# EAGLE schematic Digital BMS Slave board  (EAGLE 9.5.2)
Assembly variants: Full_Assembly_TOP, Full_Assembly_BOT, PC_Test_TOP, PC_Test_BOT

## Sheet 1 of 2
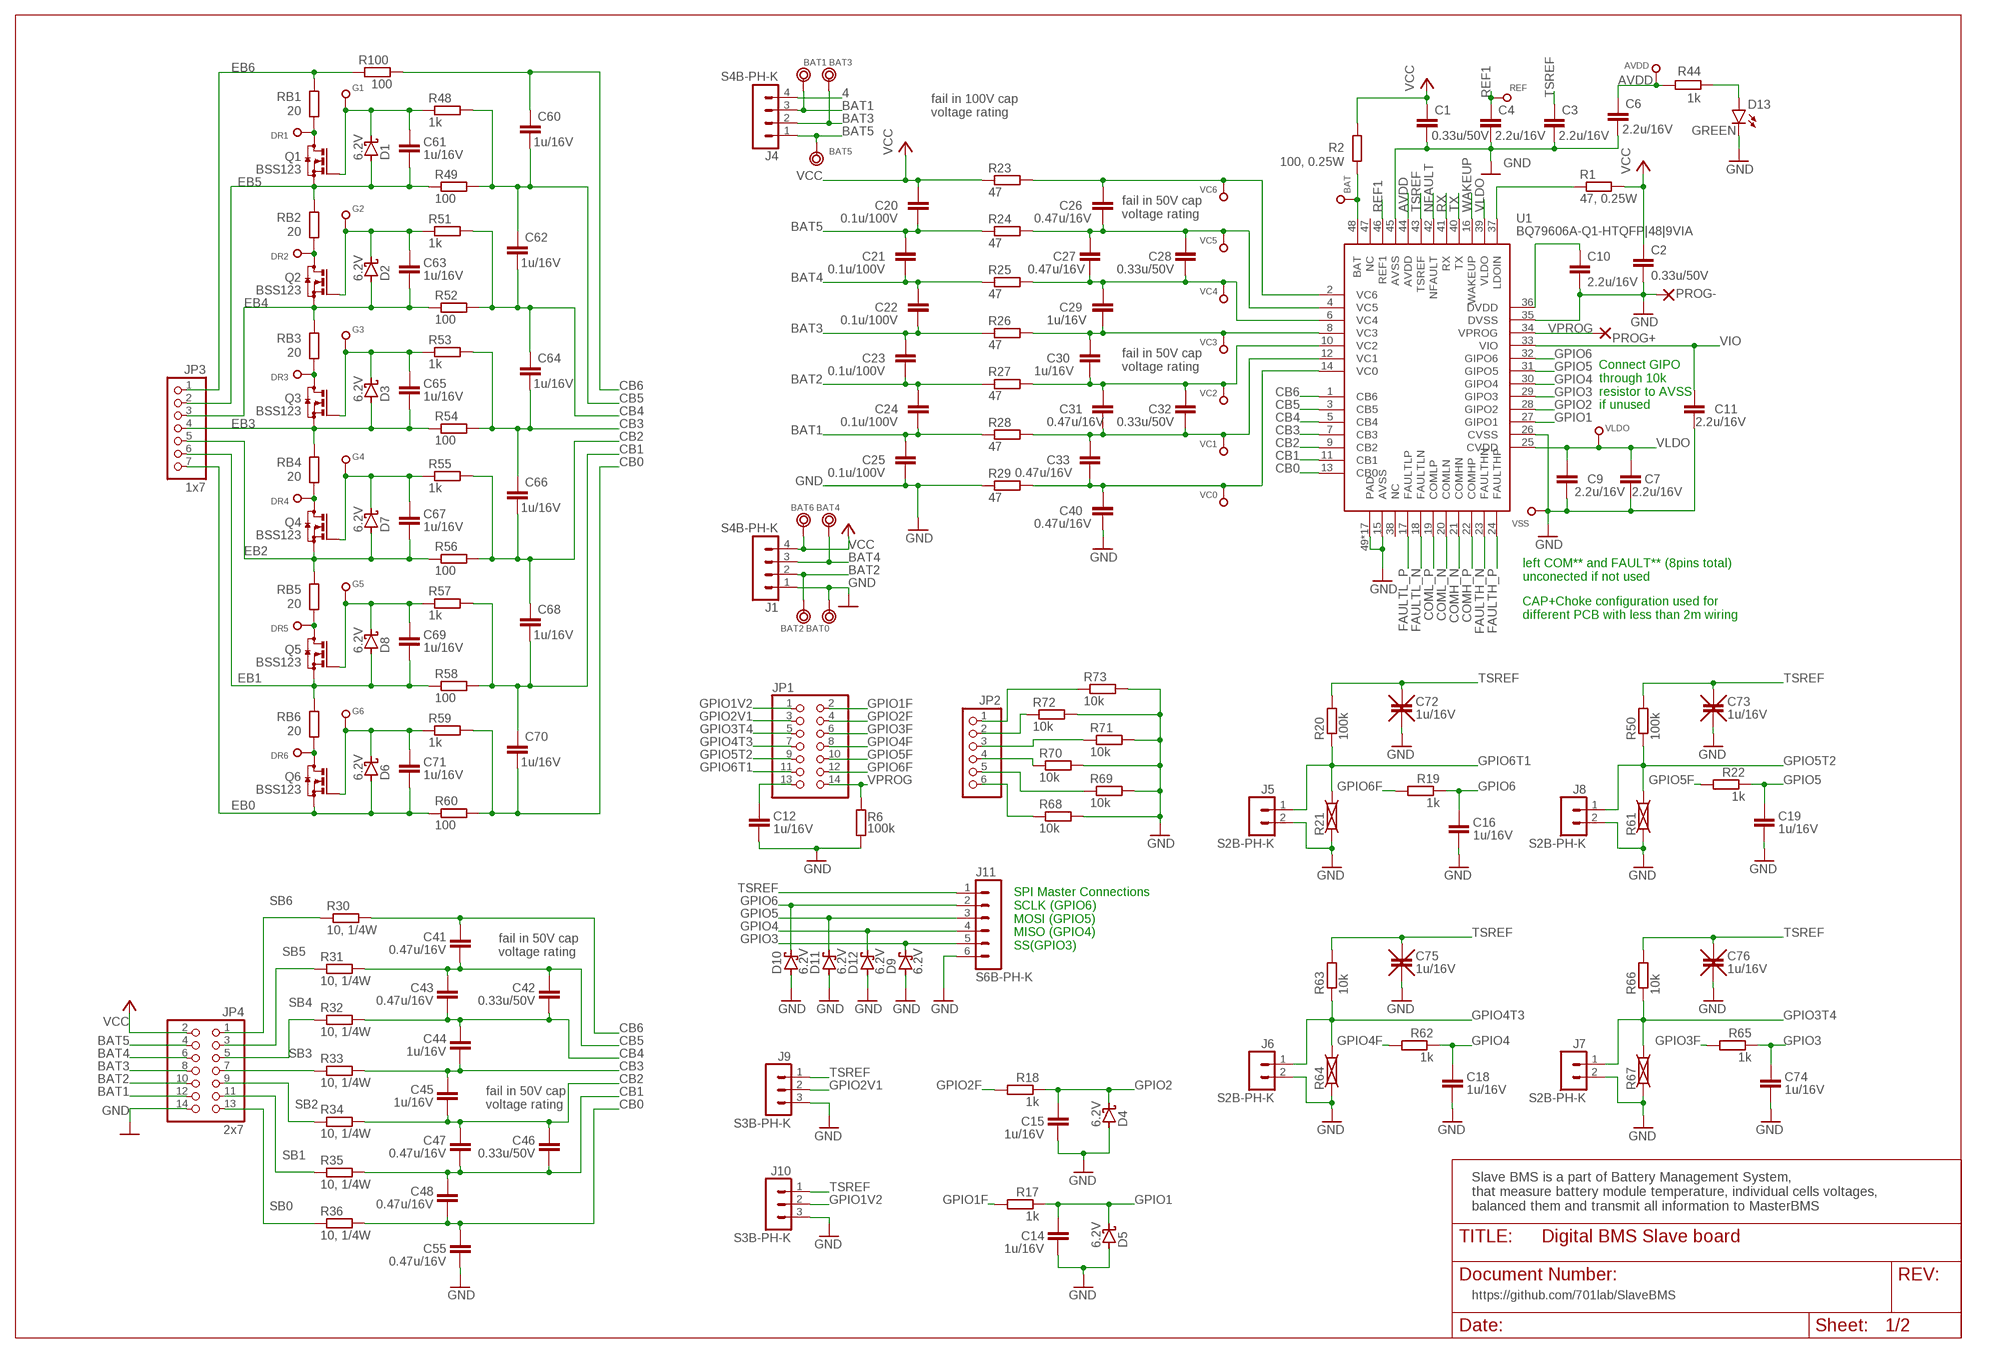
[diagram p0: schematic, sheet 1]

### Parts
AVDD  TEST_PAD-[1.27MM_SK]  [TP1.27MM_MASK_SILKSCREEN]  (not fitted in variant Full_Assembly_BOT)  (not fitted in variant PC_Test_BOT)
BAT  TEST_PAD-[1MM_SK]  [TP1MM_MASK_SILKSCREEN]  (not fitted in variant Full_Assembly_BOT)  (not fitted in variant PC_Test_BOT)
BAT0  TEST_RING  [TEST_RING]  (not fitted in variant Full_Assembly_BOT)  (not fitted in variant PC_Test_BOT)
BAT1  TEST_RING  [TEST_RING]  (not fitted in variant Full_Assembly_BOT)  (not fitted in variant PC_Test_BOT)
BAT2  TEST_RING  [TEST_RING]  (not fitted in variant Full_Assembly_BOT)  (not fitted in variant PC_Test_BOT)
BAT3  TEST_RING  [TEST_RING]  (not fitted in variant Full_Assembly_BOT)  (not fitted in variant PC_Test_BOT)
BAT4  TEST_RING  [TEST_RING]  (not fitted in variant Full_Assembly_BOT)  (not fitted in variant PC_Test_BOT)
BAT5  TEST_RING  [TEST_RING]  (not fitted in variant Full_Assembly_BOT)  (not fitted in variant PC_Test_BOT)
BAT6  TEST_RING  [TEST_RING]  (not fitted in variant Full_Assembly_BOT)  (not fitted in variant PC_Test_BOT)
C1  0.33u/50V  C-EU-K1206  [C1206K]  (not fitted in variant Full_Assembly_BOT)  (not fitted in variant PC_Test_BOT)
C2  0.33u/50V  C-EU-K1206  [C1206K]  (not fitted in variant Full_Assembly_BOT)  (not fitted in variant PC_Test_BOT)
C3  2.2u/16V  C-EU0603  [C0603]  (not fitted in variant Full_Assembly_BOT)  (not fitted in variant PC_Test_BOT)
C4  2.2u/16V  C-EU0603  [C0603]  (not fitted in variant Full_Assembly_BOT)  (not fitted in variant PC_Test_BOT)
C6  2.2u/16V  C-EU0603  [C0603]  (not fitted in variant Full_Assembly_BOT)  (not fitted in variant PC_Test_BOT)
C7  2.2u/16V  C-EU0603  [C0603]  (not fitted in variant Full_Assembly_BOT)  (not fitted in variant PC_Test_BOT)
C9  2.2u/16V  C-EU0603  [C0603]  (not fitted in variant Full_Assembly_BOT)  (not fitted in variant PC_Test_BOT)
C10  2.2u/16V  C-EU0603  [C0603]  (not fitted in variant Full_Assembly_BOT)  (not fitted in variant PC_Test_BOT)
C11  2.2u/16V  C-EU0603  [C0603]  (not fitted in variant Full_Assembly_BOT)  (not fitted in variant PC_Test_BOT)
C12  1u/16V  C-EU0603  [C0603]  (not fitted in variant Full_Assembly_BOT)  (not fitted in variant PC_Test_BOT)
C14  1u/16V  C-EU0603  [C0603]  (not fitted in variant Full_Assembly_BOT)  (not fitted in variant PC_Test_BOT)
C15  1u/16V  C-EU0603  [C0603]  (not fitted in variant Full_Assembly_BOT)  (not fitted in variant PC_Test_BOT)
C16  1u/16V  C-EU0603  [C0603]  (not fitted in variant Full_Assembly_BOT)  (not fitted in variant PC_Test_BOT)
C18  1u/16V  C-EU0603  [C0603]  (not fitted in variant Full_Assembly_BOT)  (not fitted in variant PC_Test_BOT)
C19  1u/16V  C-EU0603  [C0603]  (not fitted in variant Full_Assembly_BOT)  (not fitted in variant PC_Test_BOT)
C20  0.1u/100V  C-EU-K1206  [C1206K]  (not fitted in variant Full_Assembly_BOT)  (not fitted in variant PC_Test_BOT)
C21  0.1u/100V  C-EU-K1206  [C1206K]  (not fitted in variant Full_Assembly_BOT)  (not fitted in variant PC_Test_BOT)
C22  0.1u/100V  C-EU-K1206  [C1206K]  (not fitted in variant Full_Assembly_BOT)  (not fitted in variant PC_Test_BOT)
C23  0.1u/100V  C-EU-K1206  [C1206K]  (not fitted in variant Full_Assembly_BOT)  (not fitted in variant PC_Test_BOT)
C24  0.1u/100V  C-EU-K1206  [C1206K]  (not fitted in variant Full_Assembly_BOT)  (not fitted in variant PC_Test_BOT)
C25  0.1u/100V  C-EU-K1206  [C1206K]  (not fitted in variant Full_Assembly_BOT)  (not fitted in variant PC_Test_BOT)
C26  0.47u/16V  C-EU0603  [C0603]  (not fitted in variant Full_Assembly_BOT)  (not fitted in variant PC_Test_BOT)
C27  0.47u/16V  C-EU0603  [C0603]  (not fitted in variant Full_Assembly_BOT)  (not fitted in variant PC_Test_BOT)
C28  0.33u/50V  C-EU0603  [C0603]  (not fitted in variant Full_Assembly_BOT)  (not fitted in variant PC_Test_BOT)
C29  1u/16V  C-EU-K0805  [C0805K]  (not fitted in variant Full_Assembly_BOT)  (not fitted in variant PC_Test_BOT)
C30  1u/16V  C-EU-K0805  [C0805K]  (not fitted in variant Full_Assembly_BOT)  (not fitted in variant PC_Test_BOT)
C31  0.47u/16V  C-EU0603  [C0603]  (not fitted in variant Full_Assembly_BOT)  (not fitted in variant PC_Test_BOT)
C32  0.33u/50V  C-EU0603  [C0603]  (not fitted in variant Full_Assembly_BOT)  (not fitted in variant PC_Test_BOT)
C33  0.47u/16V  C-EU0603  [C0603]  (not fitted in variant Full_Assembly_BOT)  (not fitted in variant PC_Test_BOT)
C40  0.47u/16V  C-EU0603  [C0603]  (not fitted in variant Full_Assembly_BOT)  (not fitted in variant PC_Test_BOT)
C41  0.47u/16V  C-EU0603  [C0603]  (not fitted in variant Full_Assembly_BOT)  (not fitted in variant PC_Test_BOT)
C42  0.33u/50V  C-EU0603  [C0603]  (not fitted in variant Full_Assembly_BOT)  (not fitted in variant PC_Test_BOT)
C43  0.47u/16V  C-EU0603  [C0603]  (not fitted in variant Full_Assembly_BOT)  (not fitted in variant PC_Test_BOT)
C44  1u/16V  C-EU-K0805  [C0805K]  (not fitted in variant Full_Assembly_BOT)  (not fitted in variant PC_Test_BOT)
C45  1u/16V  C-EU-K0805  [C0805K]  (not fitted in variant Full_Assembly_BOT)  (not fitted in variant PC_Test_BOT)
C46  0.33u/50V  C-EU0603  [C0603]  (not fitted in variant Full_Assembly_BOT)  (not fitted in variant PC_Test_BOT)
C47  0.47u/16V  C-EU0603  [C0603]  (not fitted in variant Full_Assembly_BOT)  (not fitted in variant PC_Test_BOT)
C48  0.47u/16V  C-EU0603  [C0603]  (not fitted in variant Full_Assembly_BOT)  (not fitted in variant PC_Test_BOT)
C55  0.47u/16V  C-EU0603  [C0603]  (not fitted in variant Full_Assembly_BOT)  (not fitted in variant PC_Test_BOT)
C60  1u/16V  C-EU0603  [C0603]  (not fitted in variant Full_Assembly_BOT)  (not fitted in variant PC_Test_BOT)
C61  1u/16V  C-EU0603  [C0603]  (not fitted in variant Full_Assembly_BOT)  (not fitted in variant PC_Test_BOT)
C62  1u/16V  C-EU0603  [C0603]  (not fitted in variant Full_Assembly_BOT)  (not fitted in variant PC_Test_BOT)
C63  1u/16V  C-EU0603  [C0603]  (not fitted in variant Full_Assembly_BOT)  (not fitted in variant PC_Test_BOT)
C64  1u/16V  C-EU0603  [C0603]  (not fitted in variant Full_Assembly_BOT)  (not fitted in variant PC_Test_BOT)
C65  1u/16V  C-EU0603  [C0603]  (not fitted in variant Full_Assembly_BOT)  (not fitted in variant PC_Test_BOT)
C66  1u/16V  C-EU0603  [C0603]  (not fitted in variant Full_Assembly_BOT)  (not fitted in variant PC_Test_BOT)
C67  1u/16V  C-EU0603  [C0603]  (not fitted in variant Full_Assembly_BOT)  (not fitted in variant PC_Test_BOT)
C68  1u/16V  C-EU0603  [C0603]  (not fitted in variant Full_Assembly_BOT)  (not fitted in variant PC_Test_BOT)
C69  1u/16V  C-EU0603  [C0603]  (not fitted in variant Full_Assembly_BOT)  (not fitted in variant PC_Test_BOT)
C70  1u/16V  C-EU0603  [C0603]  (not fitted in variant Full_Assembly_BOT)  (not fitted in variant PC_Test_BOT)
C71  1u/16V  C-EU0603  [C0603]  (not fitted in variant Full_Assembly_BOT)  (not fitted in variant PC_Test_BOT)
C72  1u/16V  C-EU-K-X0603  [C0603K-X]  (not fitted in variant Full_Assembly_BOT)  (not fitted in variant PC_Test_BOT)
C73  1u/16V  C-EU-K-X0603  [C0603K-X]  (not fitted in variant Full_Assembly_BOT)  (not fitted in variant PC_Test_BOT)
C74  1u/16V  C-EU0603  [C0603]  (not fitted in variant Full_Assembly_BOT)  (not fitted in variant PC_Test_BOT)
C75  1u/16V  C-EU-K-X0603  [C0603K-X]  (not fitted in variant Full_Assembly_BOT)  (not fitted in variant PC_Test_BOT)
C76  1u/16V  C-EU-K-X0603  [C0603K-X]  (not fitted in variant Full_Assembly_BOT)  (not fitted in variant PC_Test_BOT)
D1  6.2V  SOD323-ZENER  [SOD323_ST]  (not fitted in variant Full_Assembly_BOT)  (not fitted in variant PC_Test_BOT)
D2  6.2V  SOD323-ZENER  [SOD323_ST]  (not fitted in variant Full_Assembly_BOT)  (not fitted in variant PC_Test_BOT)
D3  6.2V  SOD323-ZENER  [SOD323_ST]  (not fitted in variant Full_Assembly_BOT)  (not fitted in variant PC_Test_BOT)
D4  6.2V  SOD323-ZENER  [SOD323_ST]  (not fitted in variant Full_Assembly_BOT)  (not fitted in variant PC_Test_BOT)
D5  6.2V  SOD323-ZENER  [SOD323_ST]  (not fitted in variant Full_Assembly_BOT)  (not fitted in variant PC_Test_BOT)
D6  6.2V  SOD323-ZENER  [SOD323_ST]  (not fitted in variant Full_Assembly_BOT)  (not fitted in variant PC_Test_BOT)
D7  6.2V  SOD323-ZENER  [SOD323_ST]  (not fitted in variant Full_Assembly_BOT)  (not fitted in variant PC_Test_BOT)
D8  6.2V  SOD323-ZENER  [SOD323_ST]  (not fitted in variant Full_Assembly_BOT)  (not fitted in variant PC_Test_BOT)
D9  6.2V  SOD323-ZENER  [SOD323_ST]  (not fitted in variant Full_Assembly_BOT)  (not fitted in variant PC_Test_BOT)
D10  6.2V  SOD323-ZENER  [SOD323_ST]  (not fitted in variant Full_Assembly_BOT)  (not fitted in variant PC_Test_BOT)
D11  6.2V  SOD323-ZENER  [SOD323_ST]  (not fitted in variant Full_Assembly_BOT)  (not fitted in variant PC_Test_BOT)
D12  6.2V  SOD323-ZENER  [SOD323_ST]  (not fitted in variant Full_Assembly_BOT)  (not fitted in variant PC_Test_BOT)
D13  GREEN  LED0805  [LED-0805]  (not fitted in variant Full_Assembly_BOT)  (not fitted in variant PC_Test_BOT)
DR1  TEST_PAD-[1.27MM_SK]  [TP1.27MM_MASK_SILKSCREEN]  (not fitted in variant Full_Assembly_BOT)  (not fitted in variant PC_Test_BOT)
DR2  TEST_PAD-[1.27MM_SK]  [TP1.27MM_MASK_SILKSCREEN]  (not fitted in variant Full_Assembly_BOT)  (not fitted in variant PC_Test_BOT)
DR3  TEST_PAD-[1.27MM_SK]  [TP1.27MM_MASK_SILKSCREEN]  (not fitted in variant Full_Assembly_BOT)  (not fitted in variant PC_Test_BOT)
DR4  TEST_PAD-[1.27MM_SK]  [TP1.27MM_MASK_SILKSCREEN]  (not fitted in variant Full_Assembly_BOT)  (not fitted in variant PC_Test_BOT)
DR5  TEST_PAD-[1.27MM_SK]  [TP1.27MM_MASK_SILKSCREEN]  (not fitted in variant Full_Assembly_BOT)  (not fitted in variant PC_Test_BOT)
DR6  TEST_PAD-[1.27MM_SK]  [TP1.27MM_MASK_SILKSCREEN]  (not fitted in variant Full_Assembly_BOT)  (not fitted in variant PC_Test_BOT)
G1  TEST_PAD-[1.27MM_SK]  [TP1.27MM_MASK_SILKSCREEN]  (not fitted in variant Full_Assembly_BOT)  (not fitted in variant PC_Test_BOT)
G2  TEST_PAD-[1.27MM_SK]  [TP1.27MM_MASK_SILKSCREEN]  (not fitted in variant Full_Assembly_BOT)  (not fitted in variant PC_Test_BOT)
G3  TEST_PAD-[1.27MM_SK]  [TP1.27MM_MASK_SILKSCREEN]  (not fitted in variant Full_Assembly_BOT)  (not fitted in variant PC_Test_BOT)
G4  TEST_PAD-[1.27MM_SK]  [TP1.27MM_MASK_SILKSCREEN]  (not fitted in variant Full_Assembly_BOT)  (not fitted in variant PC_Test_BOT)
G5  TEST_PAD-[1.27MM_SK]  [TP1.27MM_MASK_SILKSCREEN]  (not fitted in variant Full_Assembly_BOT)  (not fitted in variant PC_Test_BOT)
G6  TEST_PAD-[1.27MM_SK]  [TP1.27MM_MASK_SILKSCREEN]  (not fitted in variant Full_Assembly_BOT)  (not fitted in variant PC_Test_BOT)
J1  S4B-PH-K  [S4B-PH-K]  (not fitted in variant Full_Assembly_TOP)  (not fitted in variant PC_Test_TOP)
J4  S4B-PH-K  [S4B-PH-K]  (not fitted in variant Full_Assembly_TOP)  (not fitted in variant PC_Test_TOP)
J5  S2B-PH-K  [S2B-PH-K]  (not fitted in variant Full_Assembly_TOP)  (not fitted in variant PC_Test_TOP)
J6  S2B-PH-K  [S2B-PH-K]  (not fitted in variant Full_Assembly_TOP)  (not fitted in variant PC_Test_TOP)
J7  S2B-PH-K  [S2B-PH-K]  (not fitted in variant Full_Assembly_TOP)  (not fitted in variant PC_Test_TOP)
J8  S2B-PH-K  [S2B-PH-K]  (not fitted in variant Full_Assembly_TOP)  (not fitted in variant PC_Test_TOP)
J9  S3B-PH-K  [S3B-PH-K]  (not fitted in variant Full_Assembly_TOP)  (not fitted in variant PC_Test_TOP)
J10  S3B-PH-K  [S3B-PH-K]  (not fitted in variant Full_Assembly_TOP)  (not fitted in variant PC_Test_TOP)
J11  S6B-PH-K  [S6B-PH-K]  (not fitted in variant Full_Assembly_TOP)  (not fitted in variant PC_Test_TOP)
JP1  PINHD-2X7  [2X07]  (not fitted in variant Full_Assembly_BOT)  (not fitted in variant PC_Test_BOT)
JP2  PINHD-1X6-OCT  [1X06]  (not fitted in variant Full_Assembly_BOT)  (not fitted in variant PC_Test_BOT)
JP3  1x7  PINHD-1X7-OCT  [1X07]  (not fitted in variant Full_Assembly_BOT)  (not fitted in variant PC_Test_BOT)
JP4  2x7  PINHD-2X7  [2X07]  (not fitted in variant Full_Assembly_BOT)  (not fitted in variant PC_Test_BOT)
PROG+  SMD_PAD  [SMD_PAD]  (not fitted in variant Full_Assembly_BOT)  (not fitted in variant PC_Test_BOT)
PROG-  SMD_PAD  [SMD_PAD]  (not fitted in variant Full_Assembly_BOT)  (not fitted in variant PC_Test_BOT)
Q1  BSS123  [SOT23]  (not fitted in variant Full_Assembly_BOT)  (not fitted in variant PC_Test_BOT)
Q2  BSS123  [SOT23]  (not fitted in variant Full_Assembly_BOT)  (not fitted in variant PC_Test_BOT)
Q3  BSS123  [SOT23]  (not fitted in variant Full_Assembly_BOT)  (not fitted in variant PC_Test_BOT)
Q4  BSS123  [SOT23]  (not fitted in variant Full_Assembly_BOT)  (not fitted in variant PC_Test_BOT)
Q5  BSS123  [SOT23]  (not fitted in variant Full_Assembly_BOT)  (not fitted in variant PC_Test_BOT)
Q6  BSS123  [SOT23]  (not fitted in variant Full_Assembly_BOT)  (not fitted in variant PC_Test_BOT)
R1  47, 0.25W  R-EU1206  [R1206]  (not fitted in variant Full_Assembly_BOT)  (not fitted in variant PC_Test_BOT)
R2  100, 0.25W  R-EU0603  [R0603]  (not fitted in variant Full_Assembly_BOT)  (not fitted in variant PC_Test_BOT)
R6  100k  R-EU0603  [R0603]  (not fitted in variant Full_Assembly_BOT)  (not fitted in variant PC_Test_BOT)
R17  1k  R-EU0603  [R0603]  (not fitted in variant Full_Assembly_BOT)  (not fitted in variant PC_Test_BOT)
R18  1k  R-EU0603  [R0603]  (not fitted in variant Full_Assembly_BOT)  (not fitted in variant PC_Test_BOT)
R19  1k  R-EU0603  [R0603]  (not fitted in variant Full_Assembly_BOT)  (not fitted in variant PC_Test_BOT)
R20  100k  R-EU0603  [R0603]  (not fitted in variant Full_Assembly_BOT)  (not fitted in variant PC_Test_BOT)
R21  R-EU-X0603  [R0603-X]  (not fitted in variant Full_Assembly_BOT)  (not fitted in variant PC_Test_BOT)
R22  1k  R-EU0603  [R0603]  (not fitted in variant Full_Assembly_BOT)  (not fitted in variant PC_Test_BOT)
R23  47  R-EU0603  [R0603]  (not fitted in variant Full_Assembly_BOT)  (not fitted in variant PC_Test_BOT)
R24  47  R-EU0603  [R0603]  (not fitted in variant Full_Assembly_BOT)  (not fitted in variant PC_Test_BOT)
R25  47  R-EU0603  [R0603]  (not fitted in variant Full_Assembly_BOT)  (not fitted in variant PC_Test_BOT)
R26  47  R-EU0603  [R0603]  (not fitted in variant Full_Assembly_BOT)  (not fitted in variant PC_Test_BOT)
R27  47  R-EU0603  [R0603]  (not fitted in variant Full_Assembly_BOT)  (not fitted in variant PC_Test_BOT)
R28  47  R-EU0603  [R0603]  (not fitted in variant Full_Assembly_BOT)  (not fitted in variant PC_Test_BOT)
R29  47  R-EU0603  [R0603]  (not fitted in variant Full_Assembly_BOT)  (not fitted in variant PC_Test_BOT)
R30  10, 1/4W  R-EU1210  [R1210]  (not fitted in variant Full_Assembly_BOT)  (not fitted in variant PC_Test_BOT)
R31  10, 1/4W  R-EU1210  [R1210]  (not fitted in variant Full_Assembly_BOT)  (not fitted in variant PC_Test_BOT)
R32  10, 1/4W  R-EU1210  [R1210]  (not fitted in variant Full_Assembly_BOT)  (not fitted in variant PC_Test_BOT)
R33  10, 1/4W  R-EU1210  [R1210]  (not fitted in variant Full_Assembly_BOT)  (not fitted in variant PC_Test_BOT)
R34  10, 1/4W  R-EU1210  [R1210]  (not fitted in variant Full_Assembly_BOT)  (not fitted in variant PC_Test_BOT)
R35  10, 1/4W  R-EU1210  [R1210]  (not fitted in variant Full_Assembly_BOT)  (not fitted in variant PC_Test_BOT)
R36  10, 1/4W  R-EU1210  [R1210]  (not fitted in variant Full_Assembly_BOT)  (not fitted in variant PC_Test_BOT)
R44  1k  R-EU0603  [R0603]  (not fitted in variant Full_Assembly_BOT)  (not fitted in variant PC_Test_BOT)
R48  1k  R-EU0603  [R0603]  (not fitted in variant Full_Assembly_BOT)  (not fitted in variant PC_Test_BOT)
R49  100  R-EU0603  [R0603]  (not fitted in variant Full_Assembly_BOT)  (not fitted in variant PC_Test_BOT)
R50  100k  R-EU0603  [R0603]  (not fitted in variant Full_Assembly_BOT)  (not fitted in variant PC_Test_BOT)
R51  1k  R-EU0603  [R0603]  (not fitted in variant Full_Assembly_BOT)  (not fitted in variant PC_Test_BOT)
R52  100  R-EU0603  [R0603]  (not fitted in variant Full_Assembly_BOT)  (not fitted in variant PC_Test_BOT)
R53  1k  R-EU0603  [R0603]  (not fitted in variant Full_Assembly_BOT)  (not fitted in variant PC_Test_BOT)
R54  100  R-EU0603  [R0603]  (not fitted in variant Full_Assembly_BOT)  (not fitted in variant PC_Test_BOT)
R55  1k  R-EU0603  [R0603]  (not fitted in variant Full_Assembly_BOT)  (not fitted in variant PC_Test_BOT)
R56  100  R-EU0603  [R0603]  (not fitted in variant Full_Assembly_BOT)  (not fitted in variant PC_Test_BOT)
R57  1k  R-EU0603  [R0603]  (not fitted in variant Full_Assembly_BOT)  (not fitted in variant PC_Test_BOT)
R58  100  R-EU0603  [R0603]  (not fitted in variant Full_Assembly_BOT)  (not fitted in variant PC_Test_BOT)
R59  1k  R-EU0603  [R0603]  (not fitted in variant Full_Assembly_BOT)  (not fitted in variant PC_Test_BOT)
R60  100  R-EU0603  [R0603]  (not fitted in variant Full_Assembly_BOT)  (not fitted in variant PC_Test_BOT)
R61  R-EU-X0603  [R0603-X]  (not fitted in variant Full_Assembly_BOT)  (not fitted in variant PC_Test_BOT)
R62  1k  R-EU0603  [R0603]  (not fitted in variant Full_Assembly_BOT)  (not fitted in variant PC_Test_BOT)
R63  10k  R-EU0603  [R0603]  (not fitted in variant Full_Assembly_BOT)  (not fitted in variant PC_Test_BOT)
R64  R-EU-X0603  [R0603-X]  (not fitted in variant Full_Assembly_BOT)  (not fitted in variant PC_Test_BOT)
R65  1k  R-EU0603  [R0603]  (not fitted in variant Full_Assembly_BOT)  (not fitted in variant PC_Test_BOT)
R66  10k  R-EU0603  [R0603]  (not fitted in variant Full_Assembly_BOT)  (not fitted in variant PC_Test_BOT)
R67  R-EU-X0603  [R0603-X]  (not fitted in variant Full_Assembly_BOT)  (not fitted in variant PC_Test_BOT)
R68  10k  R-EU0603  [R0603]  (not fitted in variant Full_Assembly_BOT)  (not fitted in variant PC_Test_BOT)
R69  10k  R-EU0603  [R0603]  (not fitted in variant Full_Assembly_BOT)  (not fitted in variant PC_Test_BOT)
R70  10k  R-EU0603  [R0603]  (not fitted in variant Full_Assembly_BOT)  (not fitted in variant PC_Test_BOT)
R71  10k  R-EU0603  [R0603]  (not fitted in variant Full_Assembly_BOT)  (not fitted in variant PC_Test_BOT)
R72  10k  R-EU0603  [R0603]  (not fitted in variant Full_Assembly_BOT)  (not fitted in variant PC_Test_BOT)
R73  10k  R-EU0603  [R0603]  (not fitted in variant Full_Assembly_BOT)  (not fitted in variant PC_Test_BOT)
R100  100  R-EU0603  [R0603]  (not fitted in variant Full_Assembly_BOT)  (not fitted in variant PC_Test_BOT)
RB1  20  R-EU2512  [R2512]  (not fitted in variant Full_Assembly_BOT)  (not fitted in variant PC_Test_BOT)
RB2  20  R-EU2512  [R2512]  (not fitted in variant Full_Assembly_BOT)  (not fitted in variant PC_Test_BOT)
RB3  20  R-EU2512  [R2512]  (not fitted in variant Full_Assembly_BOT)  (not fitted in variant PC_Test_BOT)
RB4  20  R-EU2512  [R2512]  (not fitted in variant Full_Assembly_BOT)  (not fitted in variant PC_Test_BOT)
RB5  20  R-EU2512  [R2512]  (not fitted in variant Full_Assembly_BOT)  (not fitted in variant PC_Test_BOT)
RB6  20  R-EU2512  [R2512]  (not fitted in variant Full_Assembly_BOT)  (not fitted in variant PC_Test_BOT)
REF  TEST_PAD-[1MM_SK]  [TP1MM_MASK_SILKSCREEN]  (not fitted in variant Full_Assembly_BOT)  (not fitted in variant PC_Test_BOT)
U1  BQ79606A-Q1-HTQFP|48|9VIA  [HTQFP48-9X9MM-VIA]  (not fitted in variant Full_Assembly_BOT)  (not fitted in variant PC_Test_BOT)
VC0  TEST_PAD-[1MM_SK]  [TP1MM_MASK_SILKSCREEN]  (not fitted in variant Full_Assembly_BOT)  (not fitted in variant PC_Test_BOT)
VC1  TEST_PAD-[1MM_SK]  [TP1MM_MASK_SILKSCREEN]  (not fitted in variant Full_Assembly_BOT)  (not fitted in variant PC_Test_BOT)
VC2  TEST_PAD-[1MM_SK]  [TP1MM_MASK_SILKSCREEN]  (not fitted in variant Full_Assembly_BOT)  (not fitted in variant PC_Test_BOT)
VC3  TEST_PAD-[1MM_SK]  [TP1MM_MASK_SILKSCREEN]  (not fitted in variant Full_Assembly_BOT)  (not fitted in variant PC_Test_BOT)
VC4  TEST_PAD-[1MM_SK]  [TP1MM_MASK_SILKSCREEN]  (not fitted in variant Full_Assembly_BOT)  (not fitted in variant PC_Test_BOT)
VC5  TEST_PAD-[1MM_SK]  [TP1MM_MASK_SILKSCREEN]  (not fitted in variant Full_Assembly_BOT)  (not fitted in variant PC_Test_BOT)
VC6  TEST_PAD-[1MM_SK]  [TP1MM_MASK_SILKSCREEN]  (not fitted in variant Full_Assembly_BOT)  (not fitted in variant PC_Test_BOT)
VLDO  TEST_PAD-[1.27MM_SK]  [TP1.27MM_MASK_SILKSCREEN]  (not fitted in variant Full_Assembly_BOT)  (not fitted in variant PC_Test_BOT)
VSS  TEST_PAD-[1.27MM_SK]  [TP1.27MM_MASK_SILKSCREEN]  (not fitted in variant Full_Assembly_BOT)  (not fitted in variant PC_Test_BOT)

### Nets
4: J4.4
AVDD: AVDD.1 C6.1 R44.2 U1.44(AVDD)
BAT: BAT.1 R2.1 U1.48(BAT)
BAT1: BAT1.1 C24.1 C25.2 J4.3 JP4.12 R28.1 ; also sheet 2
BAT2: BAT2.1 C23.1 C24.2 J1.2 JP4.10 R27.1 ; also sheet 2
BAT3: BAT3.1 C22.1 C23.2 J4.2 JP4.8 R26.1 ; also sheet 2
BAT4: BAT4.1 C21.1 C22.2 J1.3 JP4.6 R25.1 ; also sheet 2
BAT5: BAT5.1 C20.1 C21.2 J4.1 JP4.4 R24.1 ; also sheet 2
CB0: C48.1 C55.2 C70.1 R36.2 R59.2 R60.2 U1.13(CB0)
CB1: C46.1 C47.1 C48.2 C68.1 C70.2 R35.2 R57.2 R58.2 U1.11(CB1)
CB2: C45.1 C46.2 C47.2 C66.1 C68.2 R34.2 R55.2 R56.2 U1.9(CB2)
CB3: C44.1 C45.2 C64.1 C66.2 R33.2 R53.2 R54.2 U1.7(CB3)
CB4: C42.1 C43.1 C44.2 C62.1 C64.2 R32.2 R51.2 R52.2 U1.5(CB4)
CB5: C41.1 C42.2 C43.2 C60.1 C62.2 R31.2 R48.2 R49.2 U1.3(CB5)
CB6: C41.2 C60.2 R30.2 R100.2 U1.1(CB6)
COMH_N: U1.21(COMHN) ; also sheet 2
COMH_P: U1.22(COMHP) ; also sheet 2
COML_N: U1.20(COMLN) ; also sheet 2
COML_P: U1.19(COMLP) ; also sheet 2
DVDD: C10.1 U1.36(DVDD)
EB0: C71.1 D6.A JP3.7 Q6.2(S) R60.1
EB1: C69.1 D8.A JP3.6 Q5.2(S) R58.1 RB6.2
EB2: C67.1 D7.A JP3.5 Q4.2(S) R56.1 RB5.2
EB3: C65.1 D3.A JP3.4 Q3.2(S) R54.1 RB4.2
EB4: C63.1 D2.A JP3.3 Q2.2(S) R52.1 RB3.2
EB5: C61.1 D1.A JP3.2 Q1.2(S) R49.1 RB2.2
EB6: JP3.1 R100.1 RB1.2
FAULTH_N: U1.23(FAULTHN) ; also sheet 2
FAULTH_P: U1.24(FAULTHP) ; also sheet 2
FAULTL_N: U1.18(FAULTLN) ; also sheet 2
FAULTL_P: U1.17(FAULTLP) ; also sheet 2
GND: BAT0.1 C1.1 C2.2 C3.2 C4.2 C6.2 C7.2 C9.2 C10.2 C11.2 C12.2 C14.1 C15.1 C16.1 C18.1 C19.1 C25.1 C40.1 C55.1 C72.2 C73.2 C74.1 C75.2 C76.2 D4.A D5.A D9.A D10.A D11.A D12.A D13.-(C) J1.1 J5.2 J6.2 J7.2 J8.2 J9.3 J10.3 J11.6 JP4.14 PROG-.1(P) R6.1 R21.1 R29.1 R61.1 R64.1 R67.1 R68.2 R69.2 R70.2 R71.2 R72.2 R73.2 U1.15(AVSS) U1.26(CVSS) U1.35(DVSS) U1.45(AVSS) U1.49(PAD) U1.491(PAD) U1.492(PAD) U1.493(PAD) U1.494(PAD) U1.495(PAD) U1.496(PAD) U1.497(PAD) U1.498(PAD) U1.499(PAD) U1.P$1(PAD) U1.P$2(PAD) U1.P$3(PAD) U1.P$4(PAD) U1.P$5(PAD) U1.P$6(PAD) U1.P$7(PAD) VSS.1 ; also sheet 2
GPIO1: C14.2 D5.C R17.1 U1.27(GIPO1)
GPIO1F: JP1.2 R17.2
GPIO1V2: J10.2 JP1.1
GPIO2: C15.2 D4.C R18.1 U1.28(GIPO2)
GPIO2F: JP1.4 R18.2
GPIO2V1: J9.2 JP1.3
GPIO3: C74.2 D9.C J11.5 R65.1 U1.29(GIPO3)
GPIO3F: JP1.6 R65.2
GPIO3T4: J7.1 JP1.5 R66.1 R67.2
GPIO4: C18.2 D12.C J11.4 R62.1 U1.30(GIPO4)
GPIO4F: JP1.8 R62.2
GPIO4T3: J6.1 JP1.7 R63.1 R64.2
GPIO5: C19.2 D11.C J11.3 R22.1 U1.31(GIPO5)
GPIO5F: JP1.10 R22.2
GPIO5T2: J8.1 JP1.9 R50.1 R61.2
GPIO6: C16.2 D10.C J11.2 R19.1 U1.32(GIPO6)
GPIO6F: JP1.12 R19.2
GPIO6T1: J5.1 JP1.11 R20.1 R21.2
LDOIN: R1.1 U1.37(LDOIN)
N$1: C12.1 JP1.13
N$3: DR1.1 Q1.3(D) RB1.1
N$12: JP2.1 R73.1
N$19: JP2.2 R72.1
N$20: JP2.3 R71.1
N$21: JP2.4 R70.1
N$22: DR3.1 Q3.3(D) RB3.1
N$23: JP2.5 R69.1
N$24: JP2.6 R68.1
N$28: D13.+(A) R44.1
N$30: C61.2 D1.C G1.1 Q1.1(G) R48.1
N$31: DR2.1 Q2.3(D) RB2.1
N$34: DR5.1 Q5.3(D) RB5.1
N$60: C63.2 D2.C G2.1 Q2.1(G) R51.1
N$62: C65.2 D3.C G3.1 Q3.1(G) R53.1
N$63: DR4.1 Q4.3(D) RB4.1
N$68: C67.2 D7.C G4.1 Q4.1(G) R55.1
N$70: C69.2 D8.C G5.1 Q5.1(G) R57.1
N$71: DR6.1 Q6.3(D) RB6.1
N$76: C71.2 D6.C G6.1 Q6.1(G) R59.1
NFAULT: U1.42(NFAULT) ; also sheet 2
REF1: C4.1 REF.1 U1.46(REF1)
RX: U1.41(RX) ; also sheet 2
SB0: JP4.13 R36.1
SB1: JP4.11 R35.1
SB2: JP4.9 R34.1
SB3: JP4.7 R33.1
SB4: JP4.5 R32.1
SB5: JP4.3 R31.1
SB6: JP4.1 R30.1
TSREF: C3.1 C72.1 C73.1 C75.1 C76.1 J9.1 J10.1 J11.1 R20.2 R50.2 R63.2 R66.2 U1.43(TSREF)
TX: U1.40(TX) ; also sheet 2
VC0: C33.1 C40.2 R29.2 U1.14(VC0) VC0.1
VC1: C31.1 C32.1 C33.2 R28.2 U1.12(VC1) VC1.1
VC2: C30.1 C31.2 C32.2 R27.2 U1.10(VC2) VC2.1
VC3: C29.1 C30.2 R26.2 U1.8(VC3) VC3.1
VC4: C27.1 C28.1 C29.2 R25.2 U1.6(VC4) VC4.1
VC5: C26.1 C27.2 C28.2 R24.2 U1.4(VC5) VC5.1
VC6: C26.2 R23.2 U1.2(VC6) VC6.1
VCC [Power]: BAT6.1 C1.2 C2.1 C20.2 J1.4 JP4.2 R1.2 R2.2 R23.1 ; also sheet 2
VIO: C11.1 U1.33(VIO) ; also sheet 2
VLDO: C7.1 C9.1 U1.25(CVDD) U1.39(VLDO) VLDO.1 ; also sheet 2
VPROG: JP1.14 PROG+.1(P) R6.2 U1.34(VPROG) ; also sheet 2
WAKEUP: U1.16(WAKEUP) ; also sheet 2
Unconnected: U1.38(NC) U1.47(NC)

### Notes on the sheet
- fail in 100V cap
  voltage rating
- fail in 50V cap
  voltage rating
- fail in 50V cap
  voltage rating
- Connect GIPO
  through 10k 
  resistor to AVSS 
  if unused
- left COM** and FAULT** (8pins total)
  unconected if not used
- CAP+Choke configuration used for 
  different PCB with less than 2m wiring
- SPI Master Connections
  SCLK (GPIO6)
  MOSI (GPIO5)
  MISO (GPIO4)
  SS(GPIO3)
- fail in 50V cap
  voltage rating
- fail in 50V cap
  voltage rating
- Slave BMS is a part of Battery Management System,
  that measure battery module temperature, individual cells voltages, 
  balanced them and transmit all information to MasterBMS
- https://github.com/701lab/SlaveBMS

## Sheet 2 of 2
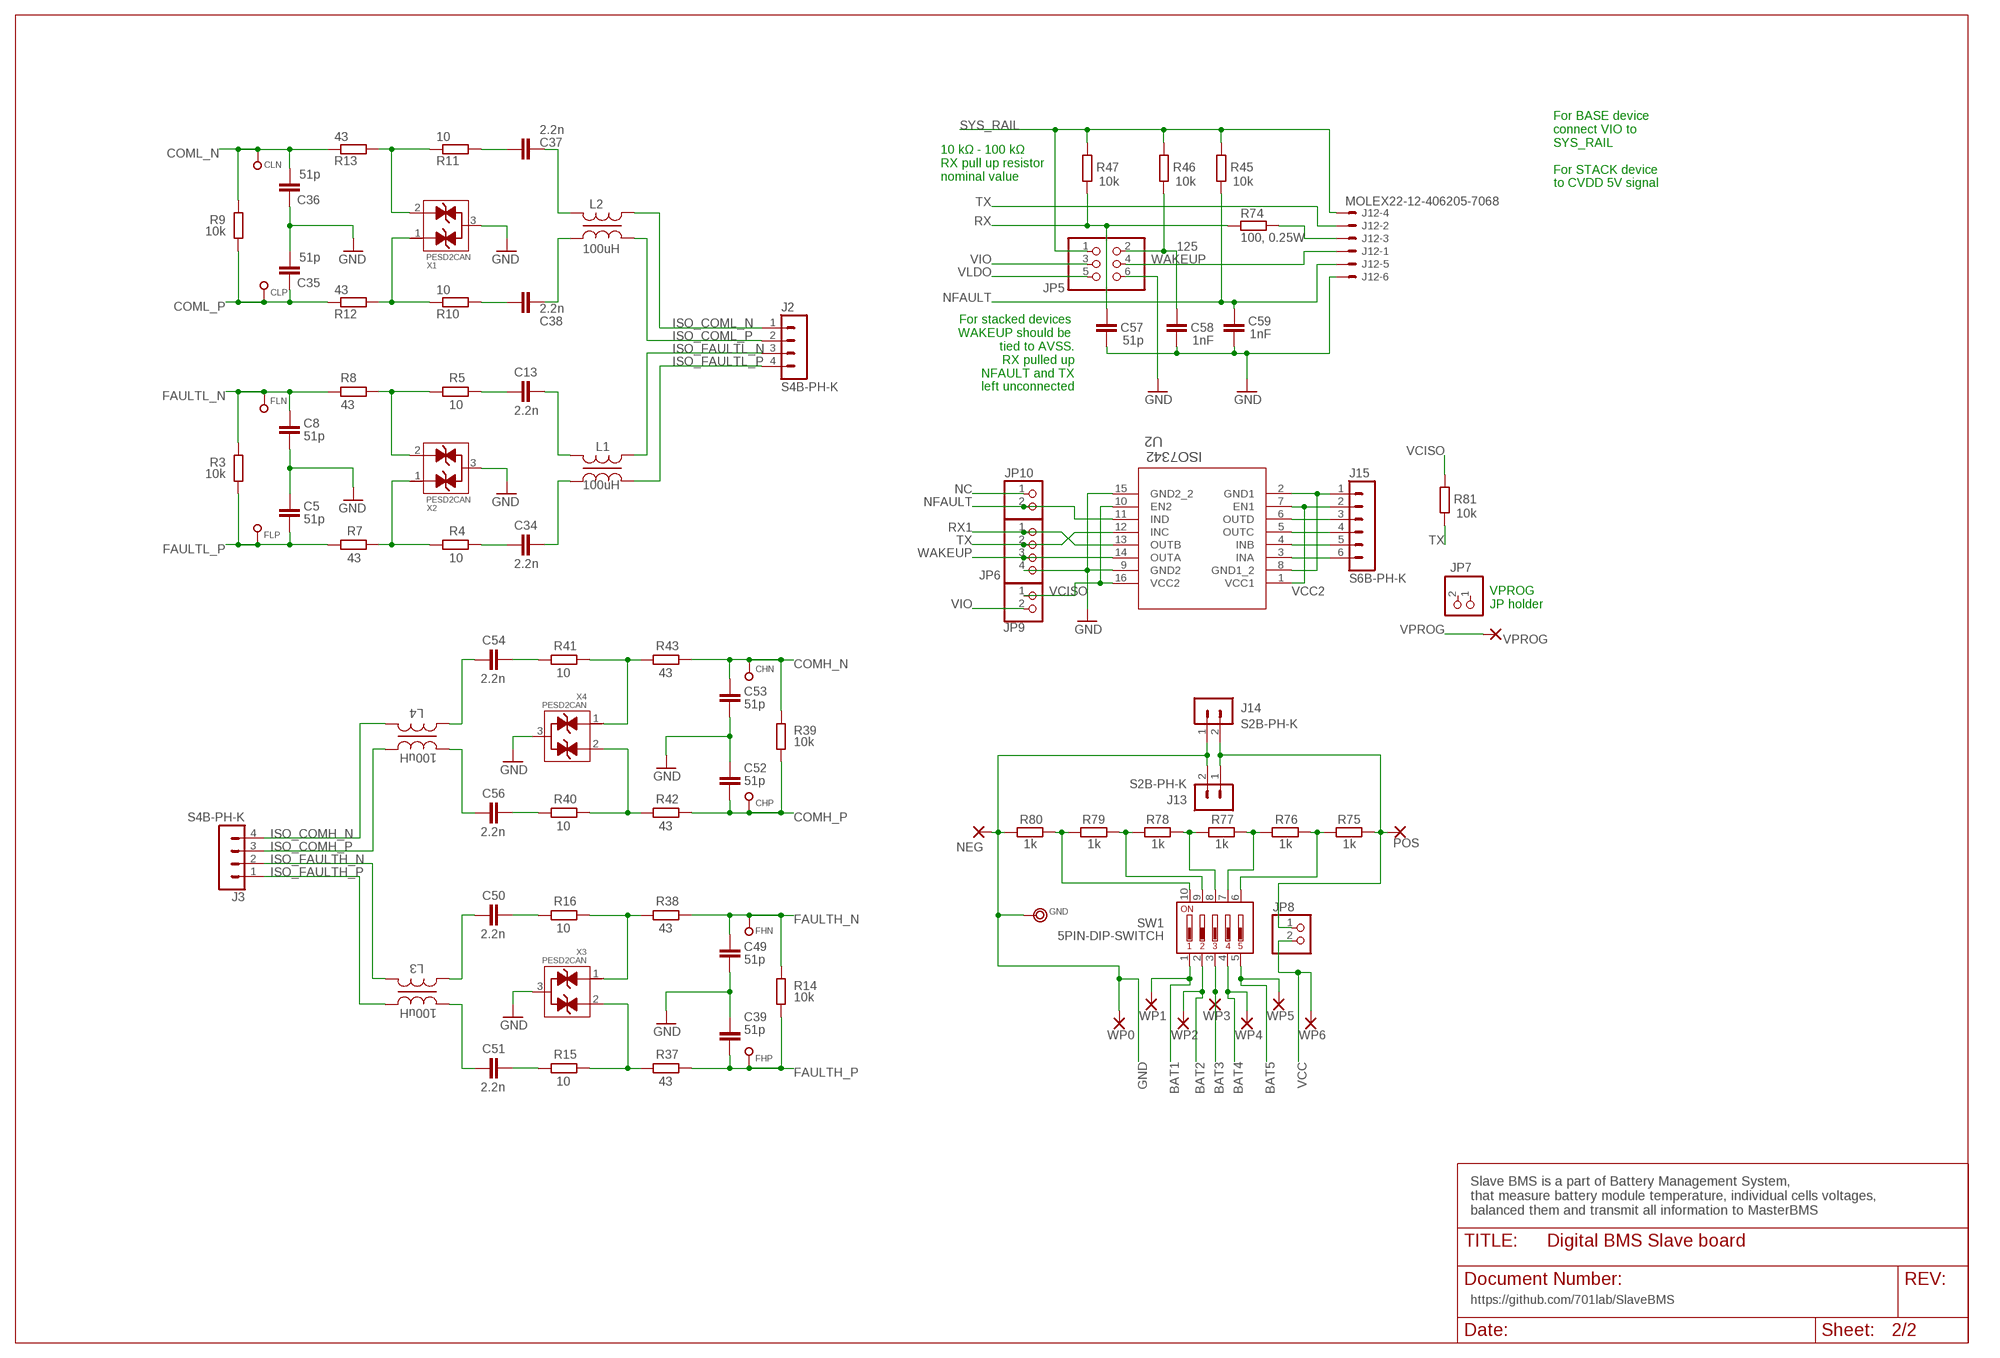
[diagram p1: schematic, sheet 2]

### Parts
C5  51p  C-EU0603  [C0603]  (not fitted in variant Full_Assembly_BOT)  (not fitted in variant PC_Test_BOT)
C8  51p  C-EU0603  [C0603]  (not fitted in variant Full_Assembly_BOT)  (not fitted in variant PC_Test_BOT)
C13  2.2n  C-EU-K1206  [C1206K]  (not fitted in variant Full_Assembly_BOT)  (not fitted in variant PC_Test_BOT)
C34  2.2n  C-EU-K1206  [C1206K]  (not fitted in variant Full_Assembly_BOT)  (not fitted in variant PC_Test_BOT)
C35  51p  C-EU0603  [C0603]  (not fitted in variant Full_Assembly_BOT)  (not fitted in variant PC_Test_BOT)
C36  51p  C-EU0603  [C0603]  (not fitted in variant Full_Assembly_BOT)  (not fitted in variant PC_Test_BOT)
C37  2.2n  C-EU-K1206  [C1206K]  (not fitted in variant Full_Assembly_BOT)  (not fitted in variant PC_Test_BOT)
C38  2.2n  C-EU-K1206  [C1206K]  (not fitted in variant Full_Assembly_BOT)  (not fitted in variant PC_Test_BOT)
C39  51p  C-EU0603  [C0603]  (not fitted in variant Full_Assembly_BOT)  (not fitted in variant PC_Test_BOT)
C49  51p  C-EU0603  [C0603]  (not fitted in variant Full_Assembly_BOT)  (not fitted in variant PC_Test_BOT)
C50  2.2n  C-EU-K1206  [C1206K]  (not fitted in variant Full_Assembly_BOT)  (not fitted in variant PC_Test_BOT)
C51  2.2n  C-EU-K1206  [C1206K]  (not fitted in variant Full_Assembly_BOT)  (not fitted in variant PC_Test_BOT)
C52  51p  C-EU0603  [C0603]  (not fitted in variant Full_Assembly_BOT)  (not fitted in variant PC_Test_BOT)
C53  51p  C-EU0603  [C0603]  (not fitted in variant Full_Assembly_BOT)  (not fitted in variant PC_Test_BOT)
C54  2.2n  C-EU-K1206  [C1206K]  (not fitted in variant Full_Assembly_BOT)  (not fitted in variant PC_Test_BOT)
C56  2.2n  C-EU-K1206  [C1206K]  (not fitted in variant Full_Assembly_BOT)  (not fitted in variant PC_Test_BOT)
C57  51p  C-EU0603  [C0603]  (not fitted in variant Full_Assembly_BOT)  (not fitted in variant PC_Test_BOT)
C58  1nF  C-EU0603  [C0603]  (not fitted in variant Full_Assembly_BOT)  (not fitted in variant PC_Test_BOT)
C59  1nF  C-EU0603  [C0603]  (not fitted in variant Full_Assembly_BOT)  (not fitted in variant PC_Test_BOT)
CHN  TEST_PAD-[1MM_SK]  [TP1MM_MASK_SILKSCREEN]  (not fitted in variant Full_Assembly_BOT)  (not fitted in variant PC_Test_BOT)
CHP  TEST_PAD-[1MM_SK]  [TP1MM_MASK_SILKSCREEN]  (not fitted in variant Full_Assembly_BOT)  (not fitted in variant PC_Test_BOT)
CLN  TEST_PAD-[1MM_SK]  [TP1MM_MASK_SILKSCREEN]  (not fitted in variant Full_Assembly_BOT)  (not fitted in variant PC_Test_BOT)
CLP  TEST_PAD-[1MM_SK]  [TP1MM_MASK_SILKSCREEN]  (not fitted in variant Full_Assembly_BOT)  (not fitted in variant PC_Test_BOT)
FHN  TEST_PAD-[1MM_SK]  [TP1MM_MASK_SILKSCREEN]  (not fitted in variant Full_Assembly_BOT)  (not fitted in variant PC_Test_BOT)
FHP  TEST_PAD-[1MM_SK]  [TP1MM_MASK_SILKSCREEN]  (not fitted in variant Full_Assembly_BOT)  (not fitted in variant PC_Test_BOT)
FLN  TEST_PAD-[1MM_SK]  [TP1MM_MASK_SILKSCREEN]  (not fitted in variant Full_Assembly_BOT)  (not fitted in variant PC_Test_BOT)
FLP  TEST_PAD-[1MM_SK]  [TP1MM_MASK_SILKSCREEN]  (not fitted in variant Full_Assembly_BOT)  (not fitted in variant PC_Test_BOT)
GND  TEST_RING  [TEST_RING]  (not fitted in variant Full_Assembly_BOT)  (not fitted in variant PC_Test_BOT)
J2  S4B-PH-K  [S4B-PH-K]  (not fitted in variant Full_Assembly_TOP)  (not fitted in variant PC_Test_TOP)
J3  S4B-PH-K  [S4B-PH-K]  (not fitted in variant Full_Assembly_TOP)  (not fitted in variant PC_Test_TOP)
J12  MOLEX22-12-406205-7068  [MOLEX22-12-4026]  (not fitted in variant Full_Assembly_TOP)  (not fitted in variant PC_Test_TOP)
J13  S2B-PH-K  [S2B-PH-K]  (not fitted in variant Full_Assembly_TOP)  (not fitted in variant PC_Test_TOP)
J14  S2B-PH-K  [S2B-PH-K]  (not fitted in variant Full_Assembly_TOP)  (not fitted in variant PC_Test_TOP)
J15  S6B-PH-K  [S6B-PH-K]  (not fitted in variant Full_Assembly_TOP)  (not fitted in variant PC_Test_TOP)  (not fitted in variant PC_Test_BOT)
JP5  PINHD-2X3  [2X03]  (not fitted in variant Full_Assembly_BOT)  (not fitted in variant PC_Test_BOT)
JP6  PINHD-1X4  [1X04]  (not fitted in variant Full_Assembly_BOT)  (not fitted in variant PC_Test_TOP)  (not fitted in variant PC_Test_BOT)
JP7  PINHD-1X2  [1X02]  (not fitted in variant Full_Assembly_BOT)  (not fitted in variant PC_Test_BOT)
JP8  PINHD-1X2  [1X02]  (not fitted in variant Full_Assembly_BOT)  (not fitted in variant PC_Test_BOT)
JP9  PINHD-1X2  [1X02]  (not fitted in variant Full_Assembly_BOT)  (not fitted in variant PC_Test_TOP)  (not fitted in variant PC_Test_BOT)
JP10  PINHD-1X2  [1X02]  (not fitted in variant Full_Assembly_BOT)  (not fitted in variant PC_Test_TOP)  (not fitted in variant PC_Test_BOT)
L1  100uH  TDK_ACT45BIND_BOURNS_SRF4532-M  [ACT45B]  (not fitted in variant Full_Assembly_BOT)  (not fitted in variant PC_Test_BOT)
L2  100uH  TDK_ACT45BIND_BOURNS_SRF4532-M  [ACT45B]  (not fitted in variant Full_Assembly_BOT)  (not fitted in variant PC_Test_BOT)
L3  100uH  TDK_ACT45BIND_BOURNS_SRF4532-M  [ACT45B]  (not fitted in variant Full_Assembly_BOT)  (not fitted in variant PC_Test_BOT)
L4  100uH  TDK_ACT45BIND_BOURNS_SRF4532-M  [ACT45B]  (not fitted in variant Full_Assembly_BOT)  (not fitted in variant PC_Test_BOT)
NEG  SMD_PAD  [SMD_PAD]  (not fitted in variant Full_Assembly_BOT)  (not fitted in variant PC_Test_BOT)
POS  SMD_PAD  [SMD_PAD]  (not fitted in variant Full_Assembly_BOT)  (not fitted in variant PC_Test_BOT)
R3  10k  R-EU0603  [R0603]  (not fitted in variant Full_Assembly_BOT)  (not fitted in variant PC_Test_BOT)
R4  10  R-EU0603  [R0603]  (not fitted in variant Full_Assembly_BOT)  (not fitted in variant PC_Test_BOT)
R5  10  R-EU0603  [R0603]  (not fitted in variant Full_Assembly_BOT)  (not fitted in variant PC_Test_BOT)
R7  43  R-EU0603  [R0603]  (not fitted in variant Full_Assembly_BOT)  (not fitted in variant PC_Test_BOT)
R8  43  R-EU0603  [R0603]  (not fitted in variant Full_Assembly_BOT)  (not fitted in variant PC_Test_BOT)
R9  10k  R-EU0603  [R0603]  (not fitted in variant Full_Assembly_BOT)  (not fitted in variant PC_Test_BOT)
R10  10  R-EU0603  [R0603]  (not fitted in variant Full_Assembly_BOT)  (not fitted in variant PC_Test_BOT)
R11  10  R-EU0603  [R0603]  (not fitted in variant Full_Assembly_BOT)  (not fitted in variant PC_Test_BOT)
R12  43  R-EU0603  [R0603]  (not fitted in variant Full_Assembly_BOT)  (not fitted in variant PC_Test_BOT)
R13  43  R-EU0603  [R0603]  (not fitted in variant Full_Assembly_BOT)  (not fitted in variant PC_Test_BOT)
R14  10k  R-EU0603  [R0603]  (not fitted in variant Full_Assembly_BOT)  (not fitted in variant PC_Test_BOT)
R15  10  R-EU0603  [R0603]  (not fitted in variant Full_Assembly_BOT)  (not fitted in variant PC_Test_BOT)
R16  10  R-EU0603  [R0603]  (not fitted in variant Full_Assembly_BOT)  (not fitted in variant PC_Test_BOT)
R37  43  R-EU0603  [R0603]  (not fitted in variant Full_Assembly_BOT)  (not fitted in variant PC_Test_BOT)
R38  43  R-EU0603  [R0603]  (not fitted in variant Full_Assembly_BOT)  (not fitted in variant PC_Test_BOT)
R39  10k  R-EU0603  [R0603]  (not fitted in variant Full_Assembly_BOT)  (not fitted in variant PC_Test_BOT)
R40  10  R-EU0603  [R0603]  (not fitted in variant Full_Assembly_BOT)  (not fitted in variant PC_Test_BOT)
R41  10  R-EU0603  [R0603]  (not fitted in variant Full_Assembly_BOT)  (not fitted in variant PC_Test_BOT)
R42  43  R-EU0603  [R0603]  (not fitted in variant Full_Assembly_BOT)  (not fitted in variant PC_Test_BOT)
R43  43  R-EU0603  [R0603]  (not fitted in variant Full_Assembly_BOT)  (not fitted in variant PC_Test_BOT)
R45  10k  R-EU0603  [R0603]  (not fitted in variant Full_Assembly_BOT)  (not fitted in variant PC_Test_BOT)
R46  10k  R-EU0603  [R0603]  (not fitted in variant Full_Assembly_BOT)  (not fitted in variant PC_Test_BOT)
R47  10k  R-EU0603  [R0603]  (not fitted in variant Full_Assembly_BOT)  (not fitted in variant PC_Test_BOT)
R74  100, 0.25W  R-EU0603  [R0603]  (not fitted in variant Full_Assembly_BOT)  (not fitted in variant PC_Test_BOT)
R75  1k  R-EU0603  [R0603]  (not fitted in variant Full_Assembly_BOT)  (not fitted in variant PC_Test_BOT)
R76  1k  R-EU0603  [R0603]  (not fitted in variant Full_Assembly_BOT)  (not fitted in variant PC_Test_BOT)
R77  1k  R-EU0603  [R0603]  (not fitted in variant Full_Assembly_BOT)  (not fitted in variant PC_Test_BOT)
R78  1k  R-EU0603  [R0603]  (not fitted in variant Full_Assembly_BOT)  (not fitted in variant PC_Test_BOT)
R79  1k  R-EU0603  [R0603]  (not fitted in variant Full_Assembly_BOT)  (not fitted in variant PC_Test_BOT)
R80  1k  R-EU0603  [R0603]  (not fitted in variant Full_Assembly_BOT)  (not fitted in variant PC_Test_BOT)
R81  10k  R-EU0603  [R0603]  (not fitted in variant Full_Assembly_BOT)  (not fitted in variant PC_Test_BOT)
SW1  5PIN-DIP-SWITCH  [DIPSWITCH-05]  (not fitted in variant Full_Assembly_BOT)  (not fitted in variant PC_Test_BOT)
U2  ISO7342  [DW0016B_N]  (not fitted in variant Full_Assembly_BOT)  (not fitted in variant PC_Test_TOP)  (not fitted in variant PC_Test_BOT)
VPROG  SMD_PAD  [SMD_PAD]  (not fitted in variant Full_Assembly_BOT)  (not fitted in variant PC_Test_BOT)
WP0  WIRE_TO_BOARD_2,54/1,1  [2,54/1,1]  (not fitted in variant Full_Assembly_BOT)  (not fitted in variant PC_Test_BOT)
WP1  WIRE_TO_BOARD_2,54/1,1  [2,54/1,1]  (not fitted in variant Full_Assembly_BOT)  (not fitted in variant PC_Test_BOT)
WP2  WIRE_TO_BOARD_2,54/1,1  [2,54/1,1]  (not fitted in variant Full_Assembly_BOT)  (not fitted in variant PC_Test_BOT)
WP3  WIRE_TO_BOARD_2,54/1,1  [2,54/1,1]  (not fitted in variant Full_Assembly_BOT)  (not fitted in variant PC_Test_BOT)
WP4  WIRE_TO_BOARD_2,54/1,1  [2,54/1,1]  (not fitted in variant Full_Assembly_BOT)  (not fitted in variant PC_Test_BOT)
WP5  WIRE_TO_BOARD_2,54/1,1  [2,54/1,1]  (not fitted in variant Full_Assembly_BOT)  (not fitted in variant PC_Test_BOT)
WP6  WIRE_TO_BOARD_2,54/1,1  [2,54/1,1]  (not fitted in variant Full_Assembly_BOT)  (not fitted in variant PC_Test_BOT)
X1  PESD2CAN  [SOT23]  (not fitted in variant Full_Assembly_BOT)  (not fitted in variant PC_Test_BOT)
X2  PESD2CAN  [SOT23]  (not fitted in variant Full_Assembly_BOT)  (not fitted in variant PC_Test_BOT)
X3  PESD2CAN  [SOT23]  (not fitted in variant Full_Assembly_BOT)  (not fitted in variant PC_Test_BOT)
X4  PESD2CAN  [SOT23]  (not fitted in variant Full_Assembly_BOT)  (not fitted in variant PC_Test_BOT)

### Nets
125: C58.2 JP5.2 R46.1
BAT1: SW1.1 WP1.1(P) ; also sheet 1
BAT2: SW1.2 WP2.1(P) ; also sheet 1
BAT3: SW1.3 WP3.1(P) ; also sheet 1
BAT4: SW1.4 WP4.1(P) ; also sheet 1
BAT5: SW1.5 WP5.1(P) ; also sheet 1
CH1_N: C54.2 R41.2
CH1_P: C56.2 R40.2
CH2_N: C54.1 L4.2
CH2_P: C56.1 L4.1
CH_N: R41.1 R43.2 X4.1
CH_P: R40.1 R42.2 X4.2
CL1_N: C37.2 R11.2
CL1_P: C38.2 R10.2
CL2_N: C37.1 L2.1
CL2_P: C38.1 L2.2
CL_N: R11.1 R13.2 X1.2
CL_P: R10.1 R12.2 X1.1
COMH_N: C53.2 CHN.1 R39.1 R43.1 ; also sheet 1
COMH_P: C52.2 CHP.1 R39.2 R42.1 ; also sheet 1
COML_N: C36.2 CLN.1 R9.1 R13.1 ; also sheet 1
COML_P: C35.2 CLP.1 R9.2 R12.1 ; also sheet 1
FAULTH_N: C49.2 FHN.1 R14.1 R38.1 ; also sheet 1
FAULTH_P: C39.2 FHP.1 R14.2 R37.1 ; also sheet 1
FAULTL_N: C8.2 FLN.1 R3.1 R8.1 ; also sheet 1
FAULTL_P: C5.2 FLP.1 R3.2 R7.1 ; also sheet 1
FH1_N: C50.2 R16.2
FH1_P: C51.2 R15.2
FH2_N: C50.1 L3.2
FH2_P: C51.1 L3.1
FH_N: R16.1 R38.2 X3.1
FH_P: R15.1 R37.2 X3.2
FL1_N: C13.2 R5.2
FL1_P: C34.2 R4.2
FL2_N: C13.1 L1.1
FL2_P: C34.1 L1.2
FL_N: R5.1 R8.2 X2.2
FL_P: R4.1 R7.2 X2.1
GND: C5.1 C8.1 C35.1 C36.1 C39.1 C49.1 C52.1 C53.1 C57.1 C58.1 C59.1 GND.1 J12.6 J13.2 J14.1 JP5.6 JP6.4 NEG.1(P) R80.2 U2.9(GND2) U2.15(GND2_2) WP0.1(P) X1.3 X2.3 X3.3 X4.3 ; also sheet 1
GND2: J15.1 U2.2(GND1) U2.8(GND1_2)
HOST_RX: J15.4 U2.5(OUTC)
HOST_TX: J15.5 U2.4(INB)
ISO_COMH_N: J3.4 L4.3
ISO_COMH_P: J3.3 L4.4
ISO_COML_N: J2.1 L2.4
ISO_COML_P: J2.2 L2.3
ISO_FAULTH_N: J3.2 L3.3
ISO_FAULTH_P: J3.1 L3.4
ISO_FAULTL_N: J2.3 L1.4
ISO_FAULTL_P: J2.4 L1.3
N$6: R77.2 R78.1 SW1.8
N$8: R76.2 R77.1 SW1.7
N$9: R75.2 R76.1 SW1.6
N$13: R79.2 R80.1 SW1.10
N$14: R78.2 R79.1 SW1.9
NC: JP10.1
NFAULT: C59.2 J12.5 JP10.2 R45.1 U2.11(IND) ; also sheet 1
NFL_ISO: J15.3 U2.6(OUTD)
POS: J13.1 J14.2 JP8.1 POS.1(P) R75.1
RX: C57.2 R47.1 R74.2 ; also sheet 1
RX1: J12.3 JP6.1 R74.1 U2.13(OUTB)
SYS_RAIL: J12.4 JP5.1 R45.2 R46.2 R47.2
TX: J12.2 JP6.2 R81.1 U2.12(INC) ; also sheet 1
VCC [Power]: JP8.2 WP6.1(P) ; also sheet 1
VCC2: J15.2 U2.1(VCC1) U2.7(EN1)
VCISO: JP9.1 R81.2 U2.10(EN2) U2.16(VCC2)
VIO: JP5.3 JP9.2 ; also sheet 1
VLDO: JP5.5 ; also sheet 1
VPROG: VPROG.1(P) ; also sheet 1
WAKEUP: J12.1 JP5.4 JP6.3 U2.14(OUTA) ; also sheet 1
WKP_ISO: J15.6 U2.3(INA)
Unconnected: JP7.1 JP7.2

### Notes on the sheet
- 10 kΩ - 100 kΩ
  RX pull up resistor
  nominal value
- For BASE device
  connect VIO to 
  SYS_RAIL 
  
  For STACK device
  to CVDD 5V signal
- For stacked devices 
  WAKEUP should be 
  tied to AVSS.
  RX pulled up
  NFAULT and TX
  left unconnected
- VPROG 
  JP holder
- Slave BMS is a part of Battery Management System,
  that measure battery module temperature, individual cells voltages, 
  balanced them and transmit all information to MasterBMS
- https://github.com/701lab/SlaveBMS

## Library data of the parts
AVDD BAT CHN CHP CLN CLP DR1-DR6 FHN FHP FLN FLP G1-G6 REF VC0 VC1-VC6 VLDO VSS = testing:TEST_PAD: Test point SMD Updated: 05.11.19 by Andrey Dovnar, andrevdovnar@gmail.com
BAT0 BAT1-BAT6 GND = testing:TEST_RING: Test rings are used to fixing multimeter probe and doing measurements hands-free Updated: 02.01.2020 by Denis Yaskevich, denis.jaskevich@yandex.by
C1 C2 C13 C20-C25 C29 C30 C34 C37 C38 C44 C45 C50 C51 C54 C56 = Capacitors:C-EU-K
C3-C12 C14-C16 C18 C19 C26-C28 C31-C33 C35 C36 C39-C43 C46-C49 C52 C53 C55 C57-C71 C74 = Capacitors:C-EU
C72 C73 C75 C76 = Capacitors:C-EU-K-X
D1-D12 = Semiconductor_devices:SOD323-ZENER: Schottky barrier diode Source: www.st.com, BAT60J.pdf
D13 = Semiconductor_devices:LED0805: LED Model suitable for all 0805 leds Updated: 22.10.19 by Andrey Dovnar, andrevdovnar@gmail.com
J1-J4 = con-jst-ph:S4B-PH-K: Wire to board connector Model suitable for S4B-PH-K Updated: 21.10.19 by Andrey Dovnar, andrevdovnar@gmail.com
J5-J8 J13 J14 = con-jst-ph:S2B-PH-K: Wire to board connector Model suitable for S2B-PH-K Updated: 21.10.19 by Andrey Dovnar, andrevdovnar@gmail.com
J9 J10 = con-jst-ph:S3B-PH-K: Wire to board connector Model suitable for S3B-PH-K Updated: 21.10.19 by Andrey Dovnar, andrevdovnar@gmail.com
J11 J15 = con-jst-ph:S6B-PH-K: Wire to board connector Model suitable for S6B-PH-K Updated: 21.10.19 by Andrey Dovnar, andrevdovnar@gmail.com
J12 = commonly used connectors:MOLEX22-12-4062: CONNECTOR wire to board 2.54 mm (.1 inch) pitch header; MF: MOLEX; OC_FARNELL: unknown; OC_NEWARK: unknown
JP1 JP4 = commonly used connectors:PINHD-2X7: PIN HEADER
JP2 = commonly used connectors:PINHD-1X6-OCT: PIN HEADER
JP3 = commonly used connectors:PINHD-1X7-OCT: PIN HEADER
JP5 = commonly used connectors:PINHD-2X3: PIN HEADER
JP6 = commonly used connectors:PINHD-1X4: PIN HEADER
JP7-JP10 = commonly used connectors:PINHD-1X2: PIN HEADER
L1-L4 = Inductors:TDK_ACT45B: 100uH
NEG POS PROG+ PROG- VPROG = testing:SMD_PAD: SMD PAD
Q1-Q6 = Semiconductor_devices:BSS123: N-CHANNEL MOS FET
R1-R20 R22-R60 R62 R63 R65 R66 R68-R81 R100 RB1-RB6 = Resistors:R-EU
R21 R61 R64 R67 = Resistors:R-EU-X
SW1 = buttons and switches:5PIN-DIP-SWITCH
U1 = texas Instrumets:BQ79606A-Q1-: Precision battery monitor Model suitable for BQ79606A-Q1 Updated: 18.10.19 by Andrey Dovnar, andrevdovnar@gmail.com HTQFP|48|9VIA package added: 07.11.19 by Denis Yaskevich, denis.jaskevich@yandex.by
U2 = texas Instrumets:ISO7342
WP0 WP1-WP6 = commonly used connectors:WIRE_TO_BOARD_2,54/1,1: THROUGH-HOLE PAD
X1-X4 = stmicroelectronics:PESD2CAN: PESD2CAN Model suitable for ???/p> Updated: 26.11.19 by Andrey Dovnar, andrevdovnar@gmail.com

## Net classes
1 Power: clearance 0.203 mm